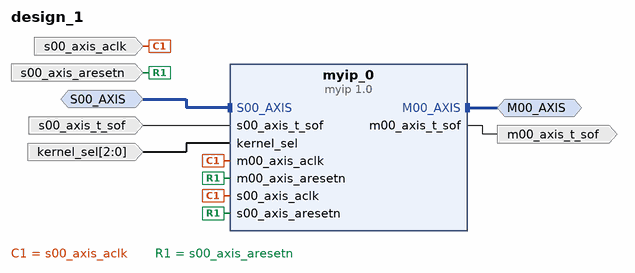
[diagram p0: block diagram of the top level]
# Vivado block design design_1, xc7z020clg484-1, Vivado 2016.3
create_bd_design design_1

create_bd_intf_port -mode Slave -vlnv xilinx.com:interface:axis_rtl:1.0 S00_AXIS
set_property -dict [list \
  CONFIG.TDATA_NUM_BYTES 4 \
  CONFIG.TDEST_WIDTH 0 \
  CONFIG.TID_WIDTH 0 \
  CONFIG.TUSER_WIDTH 0 \
  CONFIG.HAS_TREADY 1 \
  CONFIG.HAS_TSTRB 0 \
  CONFIG.HAS_TKEEP 0 \
  CONFIG.HAS_TLAST 1 \
  CONFIG.LAYERED_METADATA undef \
] [get_bd_intf_ports S00_AXIS]
create_bd_intf_port -mode Master -vlnv xilinx.com:interface:axis_rtl:1.0 M00_AXIS
create_bd_port -dir I s00_axis_t_sof
create_bd_port -dir I -type clk s00_axis_aclk
set_property -dict {CONFIG.FREQ_HZ 100000000} [get_bd_ports s00_axis_aclk]
create_bd_port -dir I -type rst s00_axis_aresetn
create_bd_port -dir I -from 2 -to 0 kernel_sel
create_bd_port -dir O m00_axis_t_sof

create_bd_cell -type ip -vlnv xilinx.com:user:myip:1.0 myip_0

# ---- connections ----

connect_bd_intf_net [get_bd_intf_ports S00_AXIS] [get_bd_intf_pins myip_0/S00_AXIS]
connect_bd_intf_net [get_bd_intf_ports M00_AXIS] [get_bd_intf_pins myip_0/M00_AXIS]
connect_bd_net [get_bd_ports s00_axis_t_sof] [get_bd_pins myip_0/s00_axis_t_sof]
connect_bd_net [get_bd_ports s00_axis_aclk] [get_bd_pins myip_0/s00_axis_aclk] [get_bd_pins myip_0/m00_axis_aclk]
connect_bd_net [get_bd_ports s00_axis_aresetn] [get_bd_pins myip_0/s00_axis_aresetn] [get_bd_pins myip_0/m00_axis_aresetn]
connect_bd_net [get_bd_ports kernel_sel] [get_bd_pins myip_0/kernel_sel]
connect_bd_net [get_bd_pins myip_0/m00_axis_t_sof] [get_bd_ports m00_axis_t_sof]

validate_bd_design
save_bd_design
